# EAGLE design CrabTimerMain (EAGLE 7.6.0)
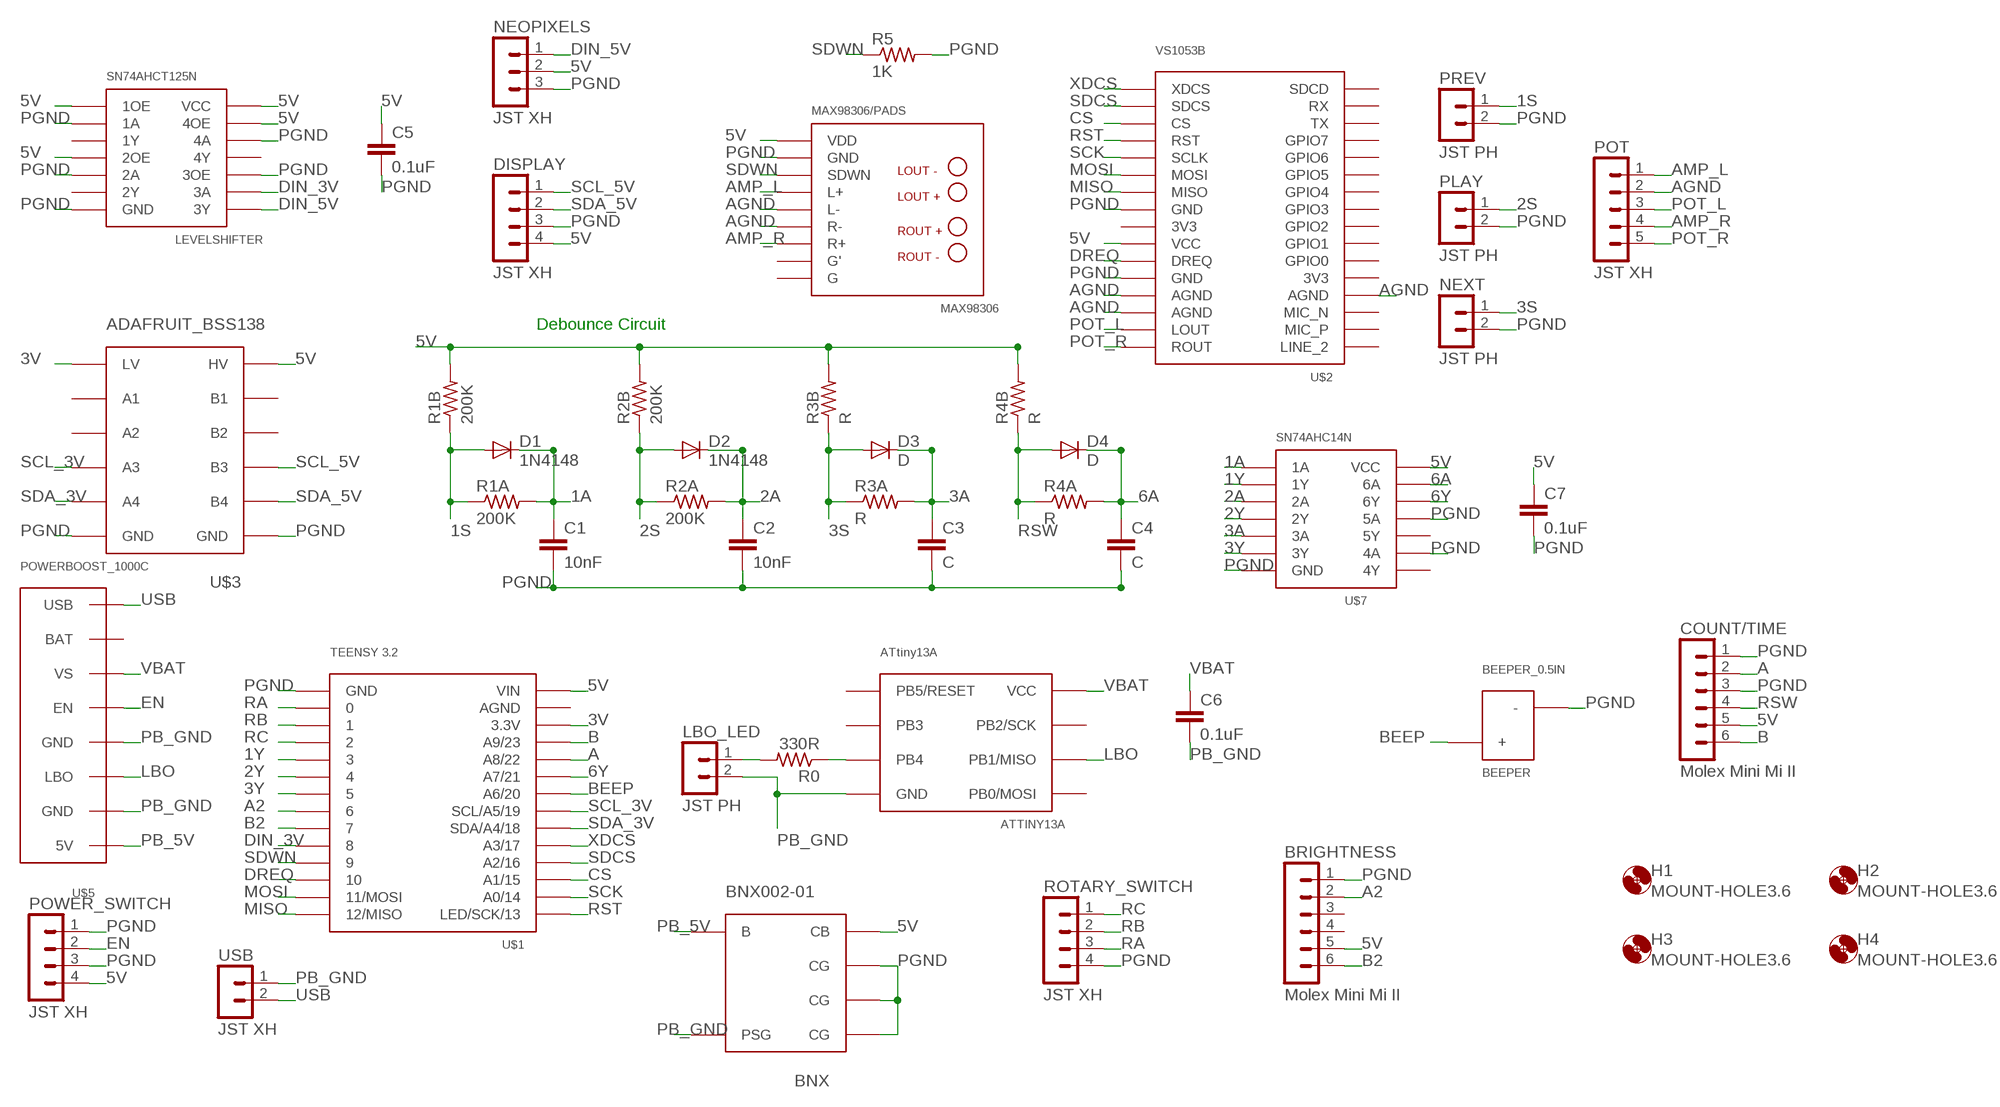
[diagram p0: schematic, sheet 1]

## Parts
ATTINY13A  ATtiny13A  ATTINY13A  [ATTINY13A]
BEEPER  BEEPER_0.5IN  [BEEPER_0.5IN]
BNX002-01  BNX  [BNX002-01]
BRIGHTNESS  Molex Mini Mi II  MOLEX-55447-0670LONG_PADS  [55447-0670]
C1  10nF  CAPACITORS0.1IN  [CAPACITOR_0.1IN]
C2  10nF  CAPACITORS0.1IN  [CAPACITOR_0.1IN]
C3  C  CAPACITORS0.1IN  [CAPACITOR_0.1IN]
C4  C  CAPACITORS0.1IN  [CAPACITOR_0.1IN]
C5  0.1uF  CAPACITORS0.1IN  [CAPACITOR_0.1IN]
C6  0.1uF  CAPACITORS0.1IN  [CAPACITOR_0.1IN]
C7  0.1uF  CAPACITORS0.1IN  [CAPACITOR_0.1IN]
COUNT/TIME  Molex Mini Mi II  MOLEX-55454-0670LONGPADS  [55454-0670]
D1  1N4148  [1N4148]
D2  1N4148  [1N4148]
D3  D  1N4148  [1N4148]
D4  D  1N4148  [1N4148]
DISPLAY  JST XH  JST-B4B-XH-A  [B4B-XH-A]
H1  MOUNT-HOLE3.6  [3,6]
H2  MOUNT-HOLE3.6  [3,6]
H3  MOUNT-HOLE3.6  [3,6]
H4  MOUNT-HOLE3.6  [3,6]
LBO_LED  JST PH  JST-B2B-PH-K-S  [B2B-PH-K-S]
LEVELSHIFTER  SN74AHCT125N  [SN74AHCT125N]
MAX98306  MAX98306/PADS  [MAX98306]
NEOPIXELS  JST XH  JST-B3B-XH-A  [B3B-XH-A]
NEXT  JST PH  JST-B2B-PH-K-S  [B2B-PH-K-S]
PLAY  JST PH  JST-B2B-PH-K-S  [B2B-PH-K-S]
POT  JST XH  JST-B5B-XH-A  [B5B-XH-A]
POWER_SWITCH  JST XH  JST-B4B-XH-A  [B4B-XH-A]
PREV  JST PH  JST-B2B-PH-K-S  [B2B-PH-K-S]
R0  330R  RESISTORS0.15IN  [RESISTOR_0.15IN]
R1A  200K  RESISTORS0.15IN  [RESISTOR_0.15IN]
R1B  200K  RESISTORS0.15IN  [RESISTOR_0.15IN]
R2A  200K  RESISTORS0.15IN  [RESISTOR_0.15IN]
R2B  200K  RESISTORS0.15IN  [RESISTOR_0.15IN]
R3A  R  RESISTORS0.15IN  [RESISTOR_0.15IN]
R3B  R  RESISTORS0.15IN  [RESISTOR_0.15IN]
R4A  R  RESISTORS0.15IN  [RESISTOR_0.15IN]
R4B  R  RESISTORS0.15IN  [RESISTOR_0.15IN]
R5  1K  RESISTORS0.15IN  [RESISTOR_0.15IN]
ROTARY_SWITCH  JST XH  JST-B4B-XH-A  [B4B-XH-A]
U$1  TEENSY 3.2  TEENSY-3.1  [TEENSY-3.1]
U$2  VS1053B  [VS1053B]
U$3  ADAFRUIT_BSS138  [ADAFRUIT_BSS138]
U$5  POWERBOOST_1000C  [POWERBOOST_1000C]
U$7  SN74AHC14N  [SN74AHC14N]
USB  JST XH  JST-B2B-XH-A  [B2B-XH-A]

## Nets
1A: C1.P$1 D1.C R1A.2 U$7.1A
1S: D1.A PREV.1 R1A.1 R1B.1
1Y: U$1.3 U$7.1Y
2A: C2.P$1 D2.C R2A.2 U$7.2A
2S: D2.A PLAY.1 R2A.1 R2B.1
2Y: U$1.4 U$7.2Y
3A: C3.P$1 D3.C R3A.2 U$7.3A
3S: D3.A NEXT.1 R3A.1 R3B.1
3V: U$1.3.3V U$3.LV
3Y: U$1.5 U$7.3Y
5V [PWR]: BNX002-01.CB BRIGHTNESS.5 C5.P$1 C7.P$1 COUNT/TIME.5 DISPLAY.4 LEVELSHIFTER.1OE LEVELSHIFTER.2OE LEVELSHIFTER.4OE LEVELSHIFTER.VCC@1(VCC) MAX98306.VDD@1(VDD) NEOPIXELS.2 POWER_SWITCH.4 R1B.2 R2B.2 R3B.2 R4B.2 U$1.VIN U$2.VCC U$3.HV U$7.VCC@1(VCC)
6A: C4.P$1 D4.C R4A.2 U$7.6A
6Y: U$1.A7/21 U$7.6Y
A: COUNT/TIME.2 U$1.A8/22
A2: BRIGHTNESS.2 U$1.6
AGND: MAX98306.L- MAX98306.R- POT.2 U$2.AGND@1(AGND) U$2.AGND@2(AGND) U$2.AGND@3(AGND)
AMP_L: MAX98306.L+ POT.1
AMP_R: MAX98306.R+ POT.4
B: COUNT/TIME.6 U$1.A9/23
B2: BRIGHTNESS.6 U$1.7
BEEP: BEEPER.+ U$1.A6/20
CS: U$1.A1/15 U$2.CS
DIN_3V: LEVELSHIFTER.3A U$1.8
DIN_5V: LEVELSHIFTER.3Y NEOPIXELS.1
DREQ: U$1.10 U$2.DREQ
EN: POWER_SWITCH.2 U$5.P$EN(EN)
LBO: ATTINY13A.PB1/MISO U$5.P$LBO(LBO)
MISO: U$1.12/MISO U$2.MISO
MOSI: U$1.11/MOSI U$2.MOSI
N$8: LBO_LED.1 R0.2
N$9: ATTINY13A.PB4 R0.1
PB_5V: BNX002-01.B U$5.P$5V(5V)
PB_GND: ATTINY13A.GND BNX002-01.PSG C6.P$2 LBO_LED.2 U$5.P$GND@1(GND) U$5.P$GND@2(GND) USB.1
PGND [PWR]: BEEPER.- BNX002-01.CG@1(CG) BNX002-01.CG@2(CG) BNX002-01.CG@3(CG) BRIGHTNESS.1 C1.P$2 C2.P$2 C3.P$2 C4.P$2 C5.P$2 C7.P$2 COUNT/TIME.1 COUNT/TIME.3 DISPLAY.3 LEVELSHIFTER.1A LEVELSHIFTER.2A LEVELSHIFTER.3OE LEVELSHIFTER.4A LEVELSHIFTER.GND@1(GND) MAX98306.GND@1(GND) NEOPIXELS.3 NEXT.2 PLAY.2 POWER_SWITCH.1 POWER_SWITCH.3 PREV.2 R5.2 ROTARY_SWITCH.4 U$1.GND U$2.GND@1(GND) U$2.GND@2(GND) U$3.GND@1(GND) U$3.GND@2(GND) U$7.4A U$7.5A U$7.GND@1(GND)
POT_L: POT.3 U$2.LOUT
POT_R: POT.5 U$2.ROUT
RA: ROTARY_SWITCH.3 U$1.0
RB: ROTARY_SWITCH.2 U$1.1
RC: ROTARY_SWITCH.1 U$1.2
RST: U$1.LED/SCK/13 U$2.RST
RSW: COUNT/TIME.4 D4.A R4A.1 R4B.1
SCK: U$1.A0/14 U$2.SCLK
SCL_3V: U$1.SCL/A5/19 U$3.A3
SCL_5V: DISPLAY.1 U$3.B3
SDA_3V: U$1.SDA/A4/18 U$3.A4
SDA_5V: DISPLAY.2 U$3.B4
SDCS: U$1.A2/16 U$2.SDCS
SDWN: MAX98306.SDWN R5.1 U$1.9
USB: U$5.P$USB(USB) USB.2
VBAT: ATTINY13A.VCC C6.P$1 U$5.P$VS(VS)
XDCS: U$1.A3/17 U$2.XDCS
Unconnected: ATTINY13A.PB0/MOSI ATTINY13A.PB2/SCK ATTINY13A.PB3 ATTINY13A.PB5/RESET BRIGHTNESS.3 BRIGHTNESS.4 LEVELSHIFTER.1Y LEVELSHIFTER.2Y LEVELSHIFTER.4Y MAX98306.G MAX98306.G' U$1.AGND U$2.3V3@1(3V3) U$2.3V3@2(3V3) U$2.GPIO0 U$2.GPIO1 U$2.GPIO2 U$2.GPIO3 U$2.GPIO4 U$2.GPIO5 U$2.GPIO6 U$2.GPIO7 U$2.LINE_2 U$2.MIC_N U$2.MIC_P U$2.RX U$2.SDCD U$2.TX U$3.A1 U$3.A2 U$3.B1 U$3.B2 U$5.P$BAT(BAT) U$7.4Y U$7.5Y

## Notes on the sheet
- Debounce Circuit

## Library data of the parts
ATTINY13A = mylibrary:ATTINY13A
BEEPER = mylibrary:BEEPER_0.5IN
BNX002-01 = mylibrary:BNX
BRIGHTNESS = mylibrary:MOLEX-55447-0670: Molex Mini Mi II / 6 Circuit / 1.25 mm For use with Bourns EM14 rotary encoders
C1-C7 = mylibrary:CAPACITORS
COUNT/TIME = mylibrary:MOLEX-55454-0670: Molex Mini Mi II / 6 Circuit / 1.25 mm For use with Bourns EM14 rotary encoders
D1-D4 = mylibrary:1N4148
DISPLAY POWER_SWITCH ROTARY_SWITCH = mylibrary:JST-B4B-XH-A: JST Connector (2.5 mm / 0.1 in) - 4 Circuit / Top Entry
H1-H4 = holes:MOUNT-HOLE: MOUNTING HOLE with drill center marker
LBO_LED NEXT PLAY PREV = mylibrary:JST-B2B-PH-K-S: JST Connector (2.0 mm / 0.08 in) - 2 Circuit / Top Entry
LEVELSHIFTER = mylibrary:SN74AHCT125N
MAX98306 = mylibrary:MAX98306/PADS
NEOPIXELS = mylibrary:JST-B3B-XH-A: JST Connector (2.5 mm / 0.1 in) - 3 Circuit / Top Entry
POT = mylibrary:JST-B5B-XH-A: JST Connector (2.5 mm / 0.1 in) - 5 Circuit / Top Entry
R0 R1A R1B R2A R2B R3A R3B R4A R4B R5 = mylibrary:RESISTORS: RESISTOR, American symbol
U$1 = mylibrary:TEENSY-3.1
U$2 = mylibrary:VS1053B
U$3 = mylibrary:ADAFRUIT_BSS138
U$5 = mylibrary:POWERBOOST_1000C
U$7 = mylibrary:SN74AHC14N
USB = mylibrary:JST-B2B-XH-A: JST Connector (2.5 mm / 0.1 in) - 2 Circuit / Top Entry

## Net classes
1 PWR: width 0.406 mm

## Board
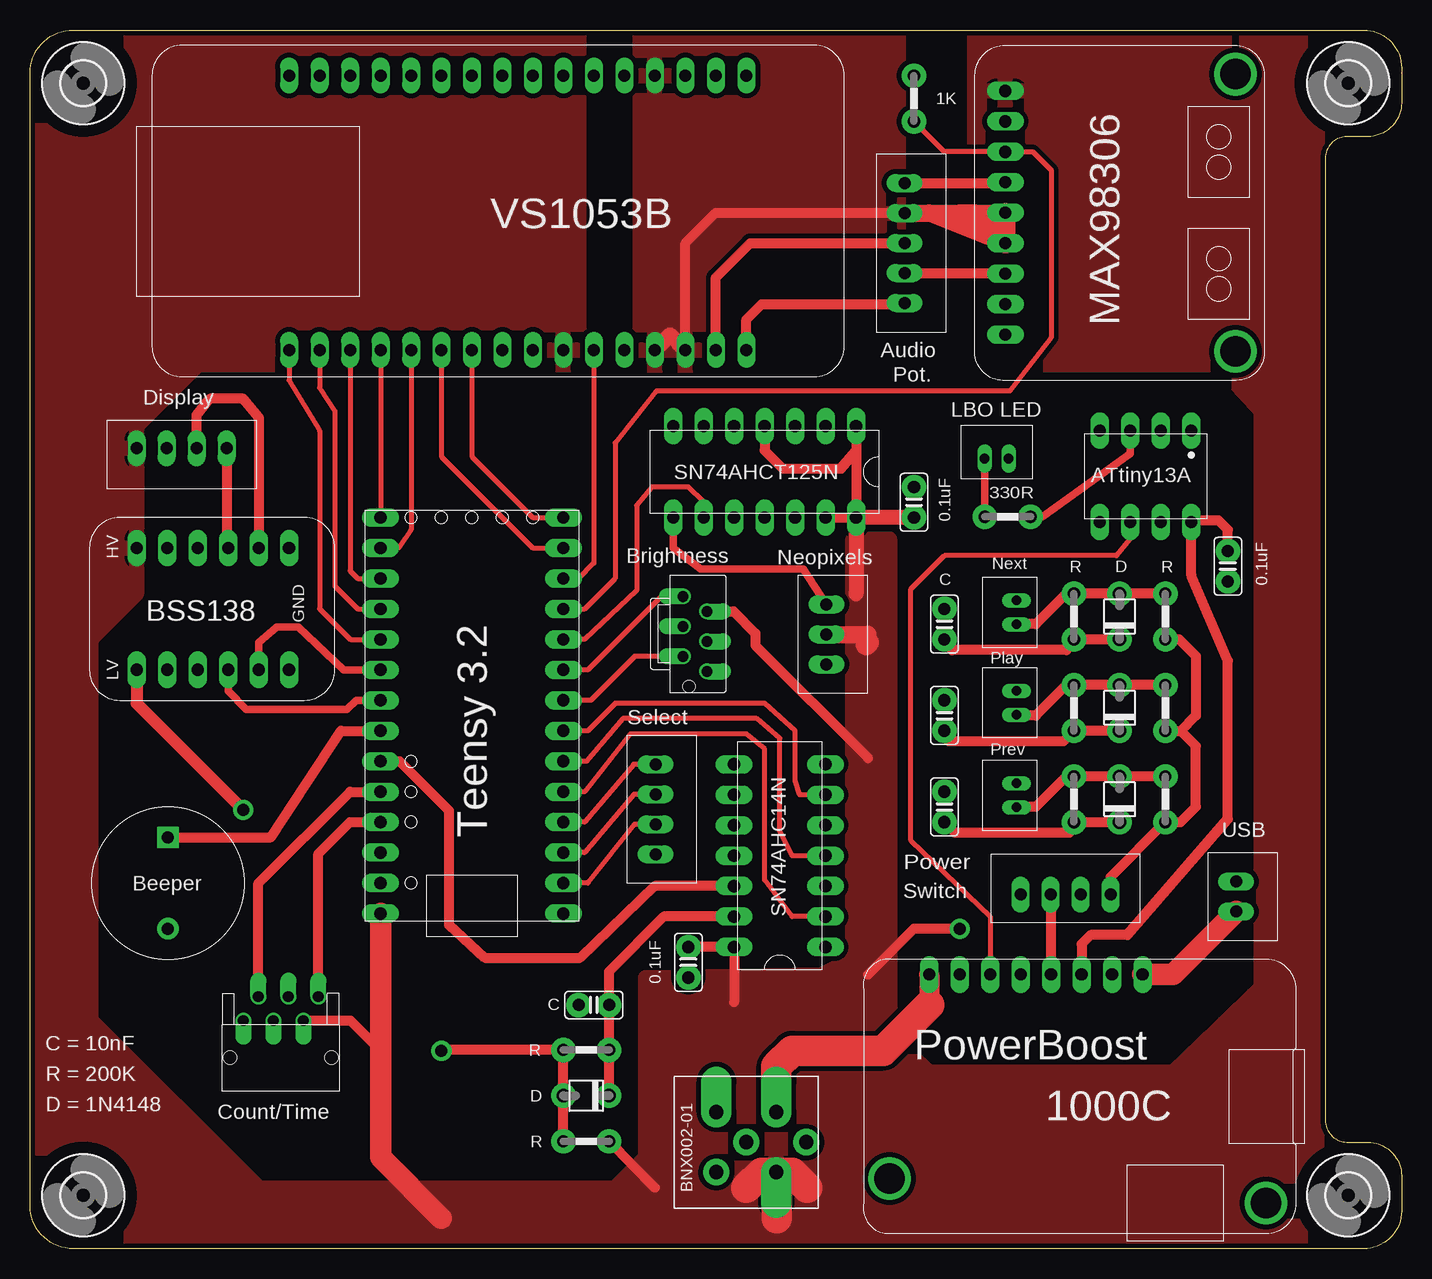
[diagram p1: board, top side]
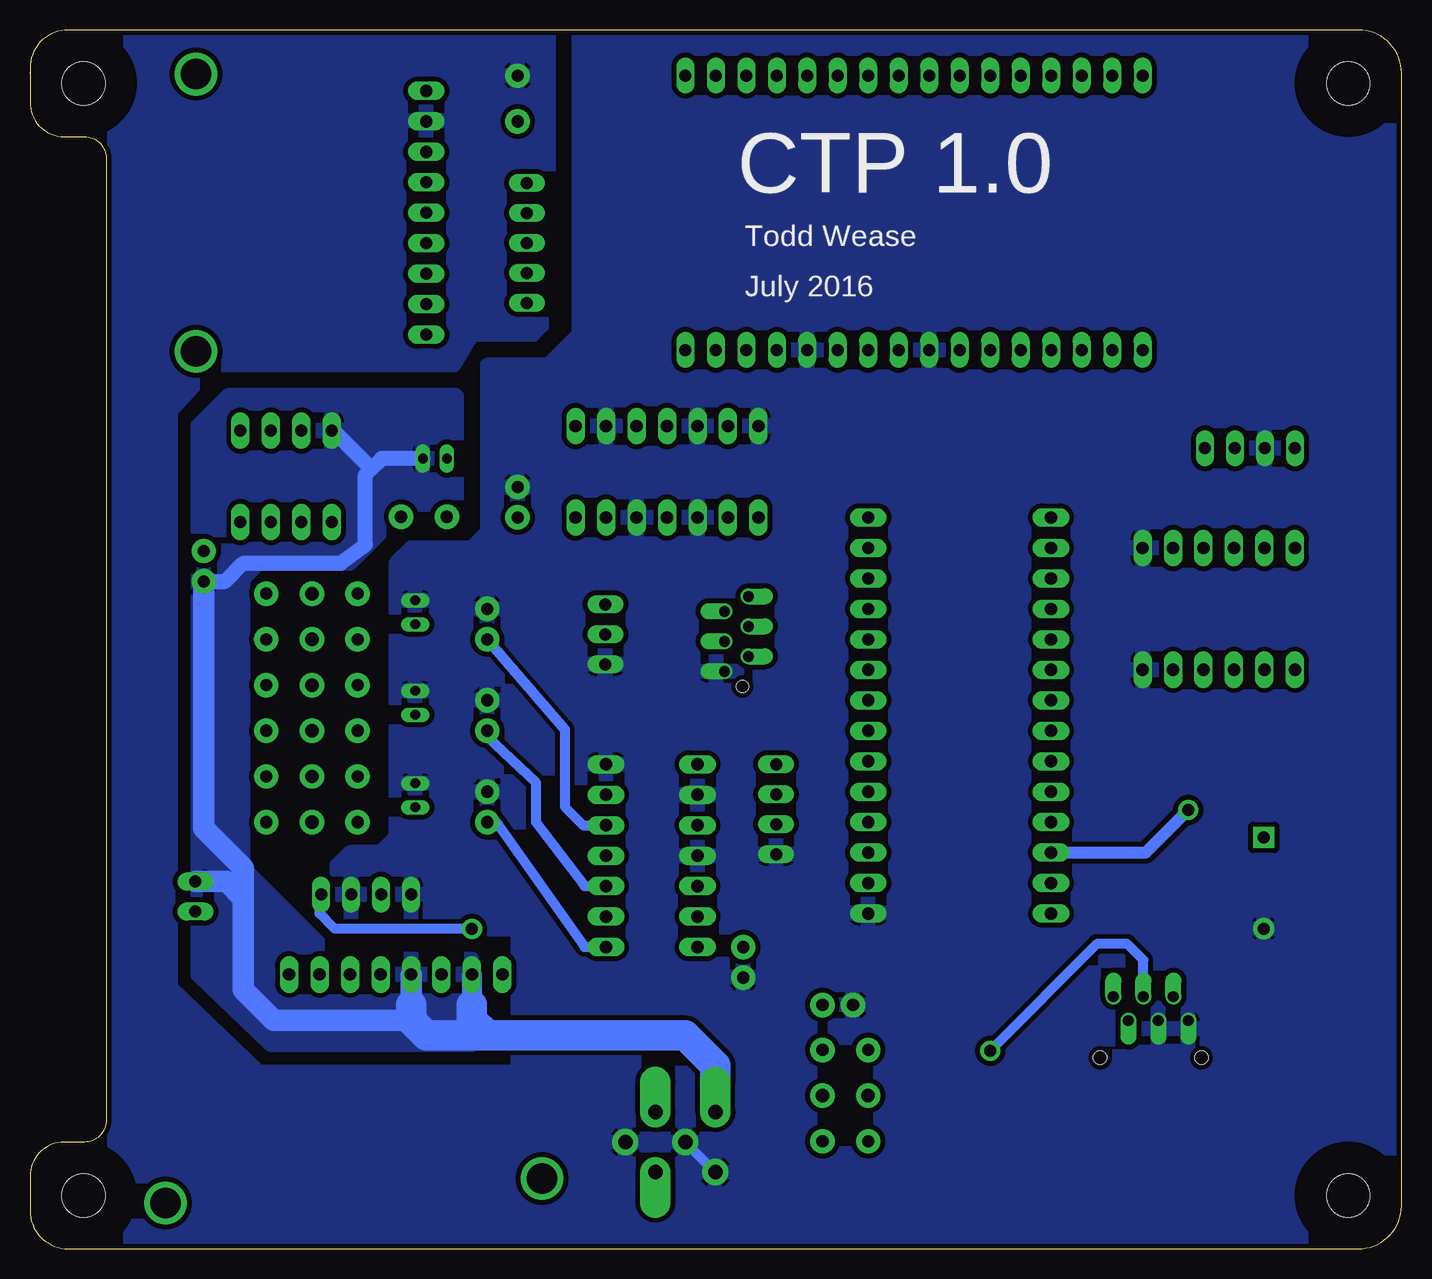
[diagram p2: board, bottom side, seen from below]

Size 114.3 x 101.6 mm. Coordinates in mm from the lower left corner, seen from the top.
Outline: 114.3,98.01 114.3,98.04
Outline: 109.75,92.71 arc90 107.95,90.91 107.95,10.69 arc90 109.75,8.89 111.46,8.89 arc-90 114.3,6.05 114.3,3.17 arc-90 111.12,0 3.59,0 arc-90 0,3.59 0,98.01 arc-90 3.59,101.6 111.12,101.6 arc-90 114.3,98.42 114.3,95.55 arc-90 111.46,92.71 109.75,92.71
Copper layers (1*16): Top 0.0356mm / dielectric 1.5011mm / Bottom 0.0356mm
Design rules "oshpark-2layer": minimum track width 6mil, minimum drill 13mil, track to track 6mil, track to pad 6mil, pad to pad 6mil, via to via 6mil, smd to smd 6mil, copper to edge 15mil, drill to drill 6mil, minimum pad ring 7mil, minimum via ring 7mil, stop-mask expansion 2.5mil, vias tented up to drill 0mil, thermal gap 10mil

### Footprints (pad centres in the part's own frame; a part is rotated, then mirrored left to right if it is on the bottom)
ATTINY13A = drill 1.016 long: GND -3.81,-3.81; PB0/MOSI 3.81,-3.81; PB1/MISO 3.81,-1.27; PB2/SCK 3.81,1.27; PB3 -3.81,1.27; PB4 -3.81,-1.27; PB5/RESET -3.81,3.81; VCC 3.81,3.81
BEEPER_0.5IN = drill 1 pad 1.778 square: + -3.81,0 | drill 1 pad 1.778: - 3.81,0
BNX002-01 = drill 1.2 pad 2.54 offset: B 2.5,2.5; CB 2.5,-2.5; PSG -2.5,2.5 | drill 1.2 pad 2.184: CG@1 -2.5,-2.5; CG@2 0,0; CG@3 5,0
55447-0670 = drill 0.9 offset: 1 1.3,-4.45; 2 -0.7,-3.2; 3 1.3,-1.95; 4 -0.7,-0.7; 5 1.3,0.55; 6 -0.7,1.8 | hole 1: -0.2,-5.7
CAPACITOR_0.1IN = drill 1.016 pad 2.032: P$1 -2.54,-1.27; P$2 0,-1.27
55454-0670 = drill 0.9 offset: 1 1.3,-4.45; 2 -0.7,-3.2; 3 1.3,-1.95; 4 -0.7,-0.7; 5 1.3,0.55; 6 -0.7,1.8 | hole 1.1: 4.4,2.9; 4.4,-5.55
1N4148 = drill 1.118 pad 2.032: A 2.54,0; C -1.27,0
B4B-XH-A = drill 1 long: 1 0.95,-1.65; 2 0.95,-4.15; 3 0.95,-6.65; 4 0.95,-9.15
3,6 = hole 3.6: 0,0
B2B-PH-K-S = drill 0.8 long: 1 -0.55,-0.75; 2 -0.55,-2.75
SN74AHCT125N = drill 1.016 long: 1A -5.08,5.08; 1OE -5.08,7.62; 1Y -5.08,2.54; 2A -5.08,-2.54; 2OE -5.08,0; 2Y -5.08,-5.08; 3A 2.54,-5.08; 3OE 2.54,-2.54; 3Y 2.54,-7.62; 4A 2.54,2.54; 4OE 2.54,5.08; 4Y 2.54,0; GND@1 -5.08,-7.62; VCC@1 2.54,7.62
MAX98306 = drill 1.016 long: G -8.89,-12.7; G' -8.89,-10.16; GND@1 -8.89,5.08; L+ -8.89,0; L- -8.89,-2.54; R+ -8.89,-7.62; R- -8.89,-5.08; SDWN -8.89,2.54; VDD@1 -8.89,7.62 | drill 2.54: P$1 10.287,9.017; P$2 10.287,-14.097
B3B-XH-A = drill 1 long: 1 0.95,-1.65; 2 0.95,-4.15; 3 0.95,-6.65
B5B-XH-A = drill 1 long: 1 0.95,-1.65; 2 0.95,-4.15; 3 0.95,-6.65; 4 0.95,-9.15; 5 0.95,-11.65
RESISTOR_0.15IN = drill 1.016 pad 2.032: 1 -1.27,0; 2 2.54,0
TEENSY-3.1 = drill 1.016 long: 0 -7.62,5.08; 1 -7.62,2.54; 2 -7.62,0; 3 -7.62,-2.54; 3.3V 7.62,2.54; 4 -7.62,-5.08; 5 -7.62,-7.62; 6 -7.62,-10.16; 7 -7.62,-12.7; 8 -7.62,-15.24; 9 -7.62,-17.78; 10 -7.62,-20.32; 11/MOSI -7.62,-22.86; 12/MISO -7.62,-25.4; A0/14 7.62,-22.86; A1/15 7.62,-20.32; A2/16 7.62,-17.78; A3/17 7.62,-15.24; A6/20 7.62,-7.62; A7/21 7.62,-5.08; A8/22 7.62,-2.54; A9/23 7.62,0; AGND 7.62,5.08; GND -7.62,7.62; LED/SCK/13 7.62,-25.4; SCL/A5/19 7.62,-10.16; SDA/A4/18 7.62,-12.7; VIN 7.62,7.62
VS1053B = drill 1 long: 3V3@1 -11.43,-7.62; 3V3@2 11.43,-15.24; AGND@1 -11.43,-17.78; AGND@2 -11.43,-20.32; AGND@3 11.43,-17.78; CS -11.43,7.62; DREQ -11.43,-12.7; GND@1 -11.43,-5.08; GND@2 -11.43,-15.24; GPIO0 11.43,-12.7; GPIO1 11.43,-10.16; GPIO2 11.43,-7.62; GPIO3 11.43,-5.08; GPIO4 11.43,-2.54; GPIO5 11.43,0; GPIO6 11.43,2.54; GPIO7 11.43,5.08; LINE_2 11.43,-25.4; LOUT -11.43,-22.86; MIC_N 11.43,-20.32; MIC_P 11.43,-22.86; MISO -11.43,-2.54; MOSI -11.43,0; ROUT -11.43,-25.4; RST -11.43,5.08; RX 11.43,10.16; SCLK -11.43,2.54; SDCD 11.43,12.7; SDCS -11.43,10.16; TX 11.43,7.62; VCC -11.43,-10.16; XDCS -11.43,12.7
ADAFRUIT_BSS138 = drill 1.016 long: A1 -5.08,3.81; A2 -5.08,1.27; A3 -5.08,-1.27; A4 -5.08,-3.81; B1 5.08,3.81; B2 5.08,1.27; B3 5.08,-1.27; B4 5.08,-3.81; GND@1 -5.08,-6.35; GND@2 5.08,-6.35; HV 5.08,6.35; LV -5.08,6.35
POWERBOOST_1000C = drill 2.54: P$1 -15.367,8.89; P$2 16.002,6.858 | drill 1.016 long: P$5V 12.7,-10.16; P$BAT -2.54,-10.16; P$EN 2.54,-10.16; P$GND@1 5.08,-10.16; P$GND@2 10.16,-10.16; P$LBO 7.62,-10.16; P$USB -5.08,-10.16; P$VS 0,-10.16
SN74AHC14N = drill 1.016 long: 1A -5.08,7.62; 1Y -5.08,5.08; 2A -5.08,2.54; 2Y -5.08,0; 3A -5.08,-2.54; 3Y -5.08,-5.08; 4A 2.54,-5.08; 4Y 2.54,-7.62; 5A 2.54,0; 5Y 2.54,-2.54; 6A 2.54,5.08; 6Y 2.54,2.54; GND@1 -5.08,-7.62; VCC@1 2.54,7.62
B2B-XH-A = drill 1 long: 1 0.95,-1.65; 2 0.95,-4.15

### Placement (x,y rotation side)
ATTINY13A  92.96,64.39 270 top
BEEPER  11.49,30.48 270 top
BNX002-01  59.69,8.89 0 top
BRIGHTNESS  55.12,52.58 0 top
C1  74.93,38.1 90 top
C2  74.93,45.72 90 top
C3  74.93,53.34 90 top
C4  45.72,19.05 180 top
C5  72.39,63.5 90 top
C6  101.09,55.63 270 top
C7  56.13,22.61 270 top
COUNT/TIME  22.23,20.32 270 top
D1  90.81,36.83 90 top
D2  90.81,44.45 90 top
D3  90.81,52.07 90 top
D4  46.99,12.76 180 top
DISPLAY  18.03,67.69 270 top
H1  4.45,4.45 0 top
H2  4.45,97.16 0 top
H3  109.86,4.45 0 top
H4  109.86,97.16 0 top
LBO_LED  78.8,66.42 90 top
LEVELSHIFTER  61.21,63.5 270 top
MAX98306  90.17,88.9 0 top
NEOPIXELS  65.41,55.37 0 top
NEXT  81.65,51.3 180 top
PLAY  81.65,43.76 180 top
POT  71.95,90.49 0 top
POWER_SWITCH  80.9,28.57 90 top
PREV  81.65,36.04 180 top
R0  82.11,61.02 180 top
R1A  87,38.1 270 top
R1B  94.61,38.1 270 top
R2A  87,45.72 270 top
R2B  94.61,45.72 270 top
R3A  87,53.34 270 top
R3B  94.61,53.34 270 top
R4A  45.72,16.57 0 top
R4B  45.72,8.95 0 top
R5  73.66,95.25 90 top
ROTARY_SWITCH  51.18,42.04 0 top
U$1  36.83,35.56 180 top
U$2  34.29,86.36 90 top
U$3  15.24,53.34 90 top
U$5  87.63,12.7 180 top
U$7  61.21,32.77 180 top
USB  99.57,32.26 0 top

### Tracks (layer width: path | path; a pad name or v marks a point on that pad's centre or on a via)
1A
  Top 0.813: D1.C R1A.2 86.61,34.67 77.09,34.67 C1.P$1
  Bottom 0.813: C1.P$1 75.44,35.56 68.07,25.15 U$7.1A
1S
  Top 0.406: 82.24,36.83 PREV.1
  Top 0.813: R1B.1 D1.A R1A.1 86.36,39.37 83.82,36.83 82.24,36.83
1Y
  Top 0.406: U$7.1Y 63.5,27.69 61.21,30.73 61.21,41.66 59.69,42.93 50.04,42.93 46.23,38.1 U$1.3
2A
  Top 0.813: D2.C R2A.2 86.11,42.29 76.58,42.29 C2.P$1
  Bottom 0.813: C2.P$1 76.2,42.67 72.14,38.86 72.14,35.56 68.07,30.23 U$7.2A
2S
  Top 0.406: 82.26,44.45 PLAY.1
  Top 0.813: R2B.1 D2.A R2A.1 86.36,46.99 83.82,44.45 82.26,44.45
2Y
  Top 0.406: U$7.2Y 63.5,32.77 62.48,34.8 62.48,42.55 60.58,44.2 49.4,44.2 46.35,40.64 U$1.4
3A
  Top 0.813: D3.C R3A.2 86.36,49.91 76.83,49.91 C3.P$1
  Bottom 0.813: U$7.3A 68.2,35.31 69.72,36.83 69.72,43.31 C3.P$1
3S
  Top 0.406: 82.22,52.07 NEXT.1
  Top 0.813: R3B.1 D3.A R3A.1 86.36,54.61 83.82,52.07 82.22,52.07
3V  (via drill 1 pad 1.68)
  Top 1.016: U$3.LV 8.89,45.47 v17.78,36.58
  Bottom 1.016: U$1.3.3V 21.34,33.02 v17.78,36.58
3Y
  Top 0.406: U$7.3Y 64.14,37.85 63.75,38.99 63.75,43.18 61.21,45.47 48.77,45.47 46.48,43.18 U$1.5
5V  (via drill 1 pad 1.68)
  Top 0.406: 97.16,49.28 97.16,49.4 | 29.11,19.02 29.21,18.92
  Top 0.813: 95.89,43.18 97.16,41.91 97.16,36.83 95.89,35.56 R1B.2 90.05,30.99 POWER_SWITCH.4 | R2B.2 95.89,43.18 | 95.89,43.18 97.16,44.45 97.16,49.28 | 97.16,49.4 95.76,50.8 R3B.2 | C7.P$1 U$7.VCC@1 58.67,20.57 | R4B.2 52.07,5.08 | COUNT/TIME.5 26.7,19.02 29.21,16.51 | v77.47,26.67 73.66,26.67 69.85,22.86 | LEVELSHIFTER.1OE 68.83,66.55 | 68.83,66.55 LEVELSHIFTER.VCC@1 LEVELSHIFTER.4OE | 69.85,51.22 69.68,50.38 | LEVELSHIFTER.2OE 61.21,66.55 62.74,65.02 67.56,65.02 68.83,66.55 | BRIGHTNESS.5 58.63,53.13 60.45,51.31 60.45,50.29 69.85,40.89
  Top 1.27: 68.83,54.61 LEVELSHIFTER.VCC@1 C5.P$1
  Top 1.422: NEOPIXELS.2 69.85,51.22
  Top 1.778: U$1.VIN 29.21,18.92 29.21,16.51 29.21,7.62 34.29,2.54 | 69.68,50.38 69.85,50.55
  Top 2.54: 62.23,6.35 62.23,2.54 | 62.23,6.35 63.5,6.35 64.77,5.08 | 62.23,6.35 60.96,6.35 59.69,5.08
  Bottom 0.813: 95.25,50.8 R3B.2 | v77.47,26.67 88.9,26.67 90.17,27.94 90.17,29.66 POWER_SWITCH.4
  pour Top (isolate 0.406): 45.72,101.6 45.72,73.66 13.97,73.66 8.89,68.58 8.89,54.61 5.08,50.8 5.08,19.05 19.05,5.08 48.77,5.08 51.31,7.62 51.31,22.61 66.04,22.86 68.58,24.13 68.58,59.18 71.63,59.18 71.63,17.78 74.93,14.73 95.25,14.73 102.62,21.84 102.62,69.85 99.06,73.66 80.01,73.66 78.74,74.93 78.74,101.6 114.3,101.6 114.3,0 0,0 0,101.6
6A
  Top 0.813: D4.C R4A.2 C4.P$1 48.26,23.11 52.83,27.69 U$7.6A
6Y
  Top 0.813: U$1.A7/21 30.8,40.64 34.92,36.51 34.92,26.99 37.91,24.26 45.85,24.26 52.07,30.23 U$7.6Y
A
  Top 0.813: COUNT/TIME.2 19.02,30.45 26.67,38.1 U$1.A8/22
A2
  Top 0.406: BRIGHTNESS.2 50.39,49.38 46.74,45.72 U$1.6
AGND
  Top 0.813: U$2.AGND@2 54.61,83.82 57.15,86.36 72.87,86.36 POT.2 | 81.26,86.34 MAX98306.L-
  Top 1.27: U$2.AGND@2 53.34,76.2 U$2.AGND@1
  Top 1.422: POT.2 81.26,86.34 | 74.93,86.36 MAX98306.R- 78.74,86.36 77.47,86.36
  Top 1.676: MAX98306.L- MAX98306.R-
  pour Top (isolate 0.406): 50.8,101.6 50.8,73.66 72.39,73.66 72.39,101.6
AMP_L
  Top 0.406: 81.22,88.84 MAX98306.L+
  Top 0.813: POT.1 81.22,88.84
AMP_R
  Top 0.406: 81.22,81.34 MAX98306.R+
  Top 0.813: POT.4 81.22,81.34
B
  Top 0.813: COUNT/TIME.6 24.02,32.91 26.67,35.56 U$1.A9/23
B2
  Top 0.406: BRIGHTNESS.6 52.6,54.38 46.48,48.26 U$1.7
BEEP
  Top 0.813: BEEPER.+ 20.07,34.29 25.91,43.18 U$1.A6/20
CS
  Top 0.406: U$2.CS 26.67,56.52 27.3,55.88 U$1.A1/15
DIN_3V
  Top 0.406: LEVELSHIFTER.3A 56.13,62.23 54.86,63.5 51.82,63.5 50.55,61.98 50.55,54.86 46.23,50.8 U$1.8
DIN_5V
  Top 0.61: LEVELSHIFTER.3Y 53.59,58.42 55.88,56.64 64.45,56.64 NEOPIXELS.1
DREQ
  Top 0.406: U$2.DREQ 46.99,57.15 45.72,55.88 U$1.10
EN
  Top 0.813: POWER_SWITCH.2 85.05,22.9 U$5.P$EN
LBO
  Top 0.406: ATTINY13A.PB1/MISO 91.69,59.18 90.55,57.78 76.2,57.78 73.41,54.99 73.41,34.04 80.01,27.69 U$5.P$LBO
MISO
  Top 0.406: U$2.MISO 36.83,66.04 41.91,60.96 U$1.12/MISO
MOSI
  Top 0.406: U$2.MOSI 34.29,66.04 41.91,58.42 U$1.11/MOSI
N$8
  Top 0.61: LBO_LED.1 79.55,61.03 R0.2
N$9
  Top 0.61: R0.1 84.39,61.02 91.69,66.29 ATTINY13A.PB4
PB_5V
  Top 1.676: U$5.P$5V 74.93,20.32
  Top 2.54: BNX002-01.B 62.19,15.2 63.5,16.51 71.12,16.51 74.93,20.32
PB_GND
  Bottom 1.27: C6.P$2 98.04,55.63 96.52,57.15 88.39,57.15 86.36,58.67 86.36,64.52 85.85,65.02 | 85.85,65.02 85,65.87 LBO_LED.2 | ATTINY13A.GND 89.03,68.2 85.85,65.02
  Bottom 1.676: U$5.P$GND@2 77.47,20.32
  Bottom 1.778: U$5.P$GND@1 82.55,20.32 | C6.P$2 99.82,35.05 96.52,31.75 96.52,29.21 | 96.52,29.21 96.52,21.59 93.98,19.05 82.55,19.05 | USB.1 97.92,30.61 96.52,29.21
  Bottom 2.54: BNX002-01.PSG 57.19,15.28 59.69,17.78 76.2,17.78 | 76.2,17.78 77.47,19.05 77.47,20.32 | 82.55,20.32 82.55,19.05 81.28,17.78 76.2,17.78
  pour Bottom (isolate 0.406): 78.74,71.12 97.79,71.12 100.33,68.58 100.33,22.86 94.23,17.02 77.47,17.02 77.47,24.13 88.9,24.13 96.52,31.75 96.52,55.88 95.25,57.15 87.63,57.15 83.82,60.96 80.01,60.96 78.74,62.23
PGND
  Bottom 0.813: BNX002-01.CG@2 57.15,6.35
  pour Bottom (isolate 0.406): 0,101.6 68.58,101.6 68.58,76.2 71.12,73.66 76.2,73.66 76.2,59.69 77.47,58.42 82.55,58.42 83.82,57.15 83.82,34.29 85.09,33.02 87.63,33.02 88.9,31.75 88.9,27.94 87.63,26.67 73.66,26.67 73.66,0 0,0
  pour Bottom (isolate 0.406): 71.12,101.6 71.12,77.47 72.39,76.2 77.47,76.2 78.99,73.66 99.06,73.66 102.62,69.85 102.62,21.84 95.25,14.73 66.04,14.73 66.04,0 114.3,0 114.3,101.6
POT_L
  Top 0.813: U$2.LOUT 57.15,80.96 60.01,83.82 72.37,83.82 POT.3
POT_R
  Top 0.813: U$2.ROUT 59.69,77.47 60.96,78.74 72.8,78.74 POT.5
RA
  Top 0.406: ROTARY_SWITCH.3 50.37,35.39 46.48,30.48 U$1.0
RB
  Top 0.406: ROTARY_SWITCH.2 50.33,37.89 46.23,33.02 U$1.1
RC
  Top 0.406: ROTARY_SWITCH.1 50.29,40.39 46.23,35.56 U$1.2
RST
  Top 0.406: U$2.RST U$1.LED/SCK/13
RSW  (via drill 1 pad 1.68)
  Top 0.813: R4B.1 D4.A R4A.1 34.35,16.57 v34.29,16.51
  Bottom 0.813: COUNT/TIME.4 21.52,24.07 22.86,25.4 25.4,25.4 v34.29,16.51
SCK
  Top 0.406: U$2.SCLK 31.75,59.94 30.73,58.42 U$1.A0/14
SCL_3V
  Top 0.61: U$3.A3 16.51,46.48 18.03,44.96 26.42,44.96 27.18,45.72 U$1.SCL/A5/19
SCL_5V
  Top 0.406: 16.38,58.55 U$3.B3
  Top 0.813: DISPLAY.1 16.38,58.55
SDA_3V
  Top 0.61: U$3.A4 19.05,50.55 20.57,51.82 22.35,51.82 26.16,48.26 U$1.SDA/A4/18
SDA_5V
  Top 0.813: U$3.B4 19.05,69.34 17.78,70.87 14.99,70.87 13.88,69.51 DISPLAY.2
SDCS
  Top 0.406: U$1.A2/16 27.3,53.34 25.4,55.24 25.4,69.85 24.13,71.75 U$2.SDCS
SDWN
  Top 0.406: U$1.9 46.23,53.34 48.77,55.88 48.77,67.18 52.2,71.5 81.66,71.5 85.09,75.95 85.09,89.92 83.57,91.44 MAX98306.SDWN 76.2,91.44 R5.1
USB
  Top 1.778: U$5.P$USB 95.27,22.86 USB.2
VBAT
  Top 0.813: U$5.P$VS 87.63,25.4 88.39,26.16 91.44,26.16 99.82,35.81 99.82,49.02 96.77,56.13 ATTINY13A.VCC 96.9,60.71 99.06,60.71 99.82,59.94 C6.P$1
XDCS
  Top 0.406: U$2.XDCS 21.59,72.39 24.13,68.2 24.13,53.34 26.67,50.8 U$1.A3/17

### Text on the board
tNames: Audio | Pot. | Display | LBO LED | Brightness | Neopixels | Next | BSS138 | Play | Select | Prev | Teensy 3.2 | Power | Beeper | Switch | C = 10nF | PowerBoost | R = 200K | D = 1N4148 | Count/Time | 1000C
bNames: CTP 1.0 | Todd Wease | July 2016